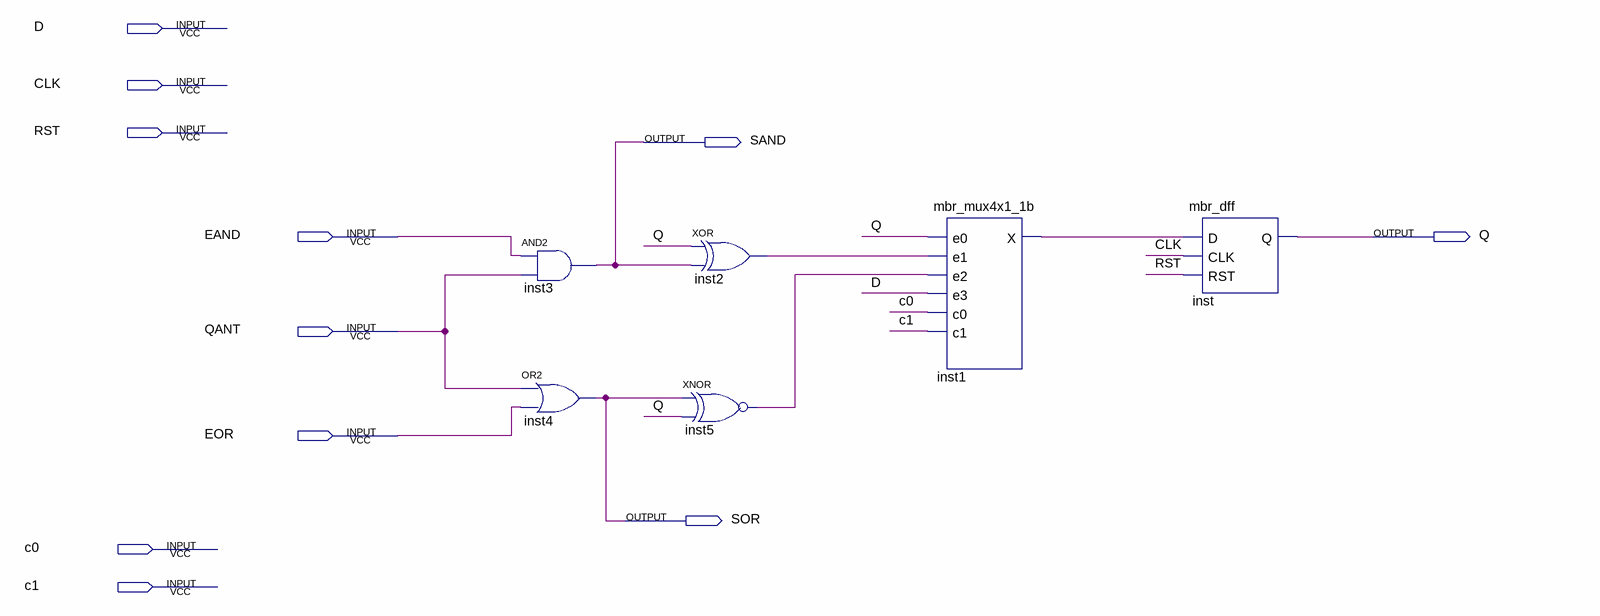
[diagram p0: schematic sheet]
// Quartus schematic mbr_cont_generico.bdf as structural Verilog: 6 symbols, 11 pins
module mbr_cont_generico (
  input  D,
  input  CLK,
  input  RST,
  input  EAND,
  input  QANT,
  input  EOR,
  input  c0,
  input  c1,
  output SAND,
  output Q,
  output SOR
);

  wire inst1_x, inst2_out, inst5_out;

  and inst3 (SAND, EAND, QANT);
  or inst4 (SOR, QANT, EOR);
  xor inst2 (inst2_out, Q, SAND);
  xnor inst5 (inst5_out, SOR, Q);
  mbr_mux4x1_1b inst1 (.e0(Q), .e1(inst2_out), .e2(inst5_out), .e3(D), .c0(c0), .c1(c1), .X(inst1_x));
  mbr_dff inst (.D(inst1_x), .CLK(CLK), .RST(RST), .Q(Q));
endmodule
